# EAGLE design power (EAGLE 5.04)
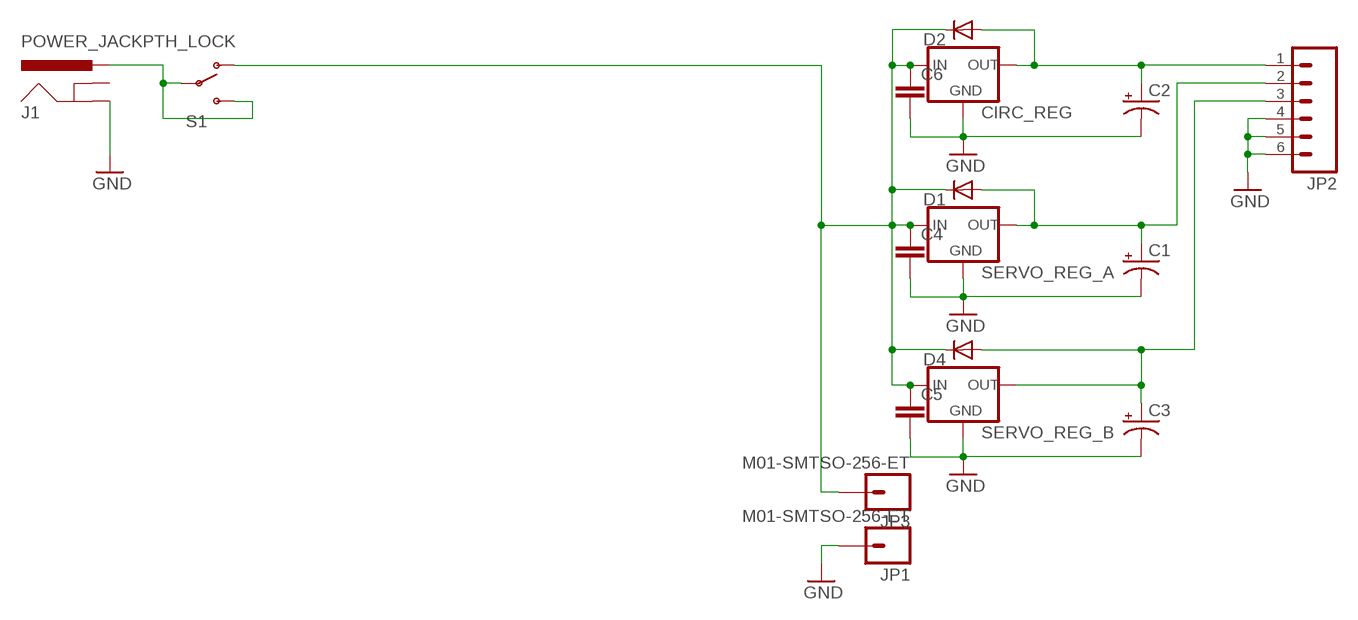
[diagram p0: schematic, sheet 1]

## Parts
C1  CAP_POLPTH1  [CPOL-RADIAL-100UF-25V]
C2  CAP_POLPTH2  [CPOL-RADIAL-10UF-25V]
C3  CAP_POLPTH1  [CPOL-RADIAL-100UF-25V]
C4  CAPPTH2  [CAP-PTH-SMALL2]
C5  CAPPTH2  [CAP-PTH-SMALL2]
C6  CAPPTH2  [CAP-PTH-SMALL2]
CIRC_REG  V_REG_78XXSIDE  [78XXL]
D1  DIODE1N4148  [DIODE-1N4148]
D2  DIODE1N4148  [DIODE-1N4148]
D4  DIODE1N4148  [DIODE-1N4148]
J1  POWER_JACKPTH_LOCK  [POWER_JACK_PTH_LOCK]
JP1  M01-SMTSO-256-ET  [SMTSO-256-ET]
JP2  M06SIP  [1X06]
JP3  M01-SMTSO-256-ET  [SMTSO-256-ET]
S1  SWITCH-SPSTPTH  [SWITCH-SPDT]
SERVO_REG_A  V_REG_78XXSIDE  [78XXL]
SERVO_REG_B  V_REG_78XXSIDE  [78XXL]

## Nets
GND: C1.2(-) C2.2(-) C3.2(-) C4.2 C5.2 C6.2 CIRC_REG.GND J1.GND JP1.P$1 JP2.4 JP2.5 JP2.6 SERVO_REG_A.GND SERVO_REG_B.GND
N$1: C2.1(+) CIRC_REG.OUT D2.A JP2.1
N$2: C1.1(+) D1.A JP2.2 SERVO_REG_A.OUT
N$4: C4.1 C5.1 C6.1 CIRC_REG.IN D1.C D2.C D4.C JP3.P$1 S1.1(O) SERVO_REG_A.IN SERVO_REG_B.IN
N$5: J1.PWR S1.2(P) S1.3(S)
N$9: C3.1(+) D4.A JP2.3 SERVO_REG_B.OUT
Unconnected: J1.GNDBREAK

## Library data of the parts
C1-C3 = SparkFun:CAP_POL: Capacitor Polarized These are standard SMD and PTH capacitors. Normally 10uF, 47uF, and 100uF in electrolytic and tantalum varieties. Always verify the external diameter of the through hole cap, it varies with capacity, voltage, and manufacturer. The EIA devices should be standard.
C4-C6 = SparkFun:CAP: Capacitor Standard 0603 ceramic capacitor, and 0.1" leaded capacitor.
CIRC_REG SERVO_REG_A SERVO_REG_B = SparkFun:V_REG_78XX: Voltage Regulator Standard 7805 5V regulator. IGO (Input Ground Output). Spark Fun Electronics SKU : COM-00107
D1 D2 D4 = SparkFun:DIODE: Diode These are standard reverse protection diodes and small signal diodes. SMA package can handle up to about 1A. SOD-323 can handle about 200mA. What the SOD-323 package when ordering, there are some mfgs out there that are 5-pin packages.
J1 = SparkFun:POWER_JACK: Power Jack This is the standard 5.5mm barrel jack for power. The PTH is the most common, proven, reliable, footprint. All others are experimental. The Slot footprint only works if the mill layer is transmitted to the PCB fab house so be warned. Spark Fun Electronics SKU : PRT-00119. Mating wall wart : TOL-00298 (and others)
JP1 JP3 = SparkFun:M01: Header 1 Standard 1-pin 0.1" header. Use with straight break away headers (SKU : PRT-00116), right angle break away headers (PRT-00553), swiss pins (PRT-00743), machine pins (PRT-00117), and female headers (PRT-00115).
JP2 = SparkFun:M06: Header 6 Standard 6-pin 0.1" header. Use with straight break away headers (SKU : PRT-00116), right angle break away headers (PRT-00553), swiss pins (PRT-00743), machine pins (PRT-00117), and female headers (PRT-00115). Molex polarized connector foot print use with SKU : PRT-08094 with associated crimp pins and housings. NOTES ON THE VARIANTS LOCK and LOCK_LONGPADS... This footprint was designed to help hold the alignment of a through-hole component (i.e. 6-pin header) while soldering it into place. You may notice that each hole has been shifted either up or down by 0.005 of an inch from it's more standard position (which is a perfectly straight line). This slight alteration caused the pins (the squares in the middle) to touch the edges of the holes. Because they are alternating, it causes a "brace" to hold the component in place. 0.005 has proven to be the perfect amount of "off-center" position when using our standard breakaway headers. Although looks a little odd when you look at the bare footprint, once you have a header in there, the alteration is very hard to notice. Also, if you push a header all the way into place, it is covered up entirely on the bottom side. This idea of altering the position of holes to aid alignment will be further integrated into the Sparkfun Library for other footprints. It can help hold any component with 3 or more connection pins.
S1 = SparkFun:SWITCH-SPST: SPST Switch Simple slide switch. Spark Fun Electronics SKU : COM-00102

## Board
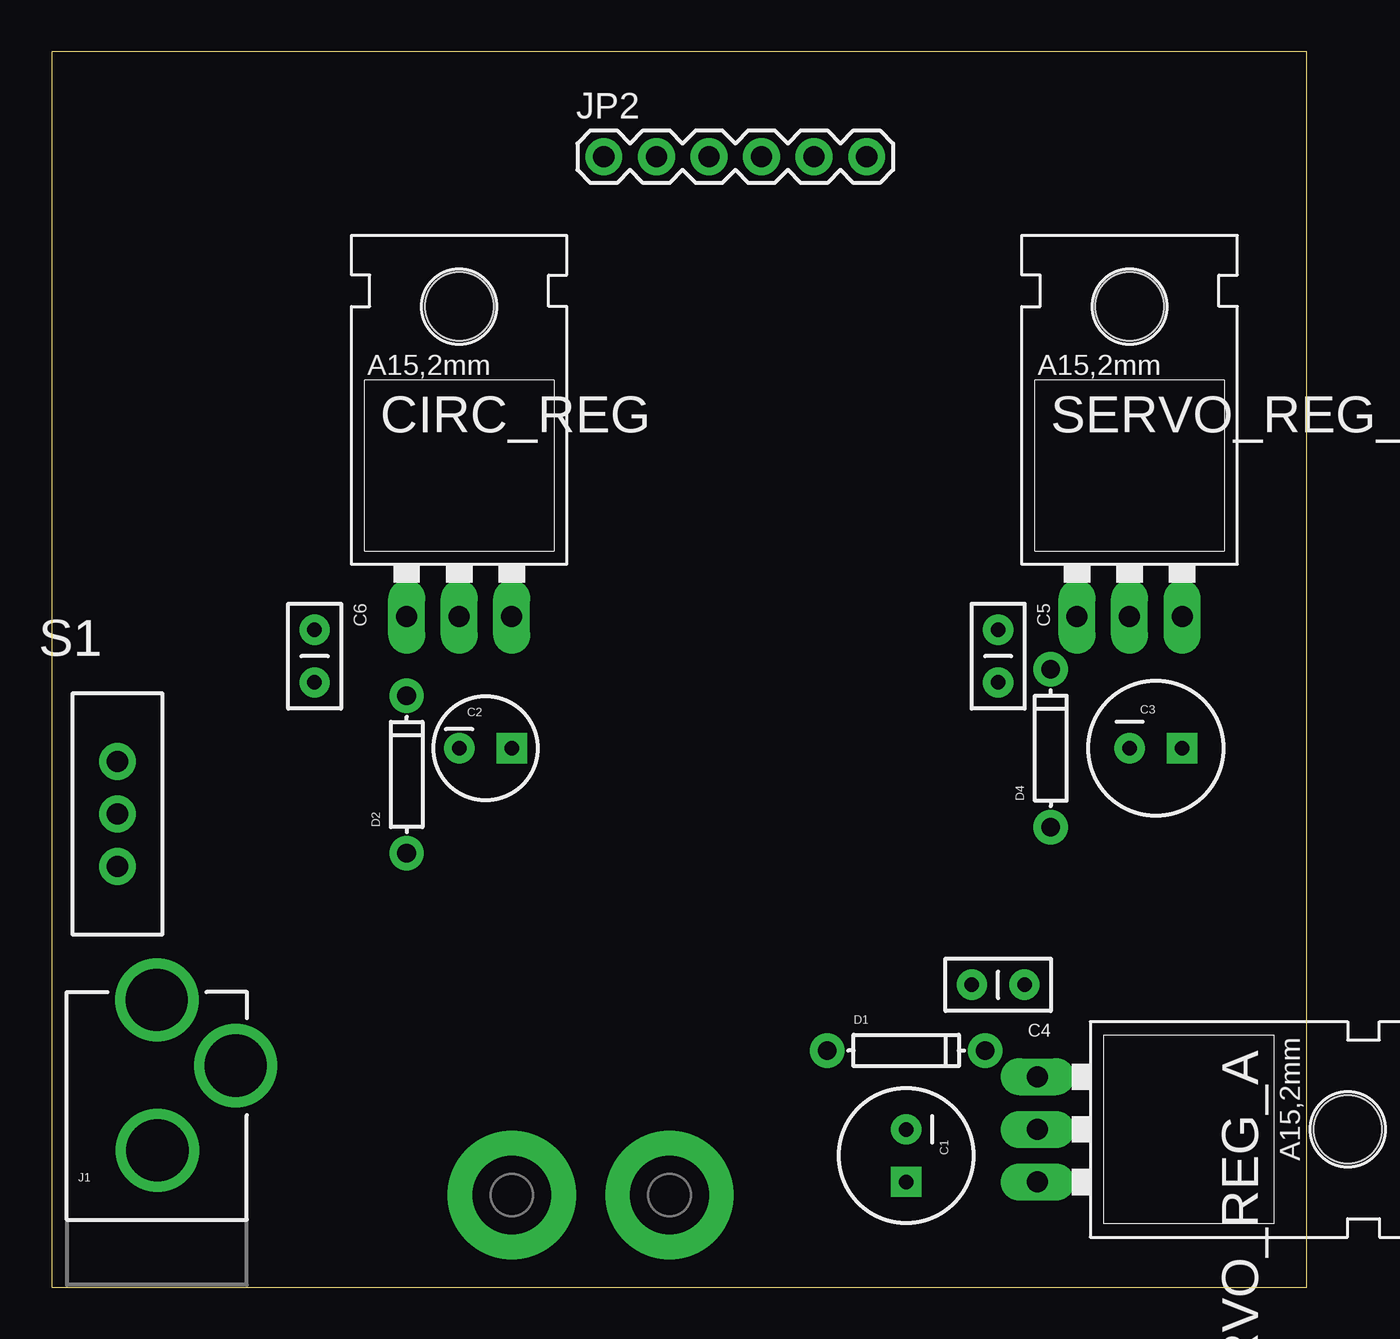
[diagram p1: board, top side]
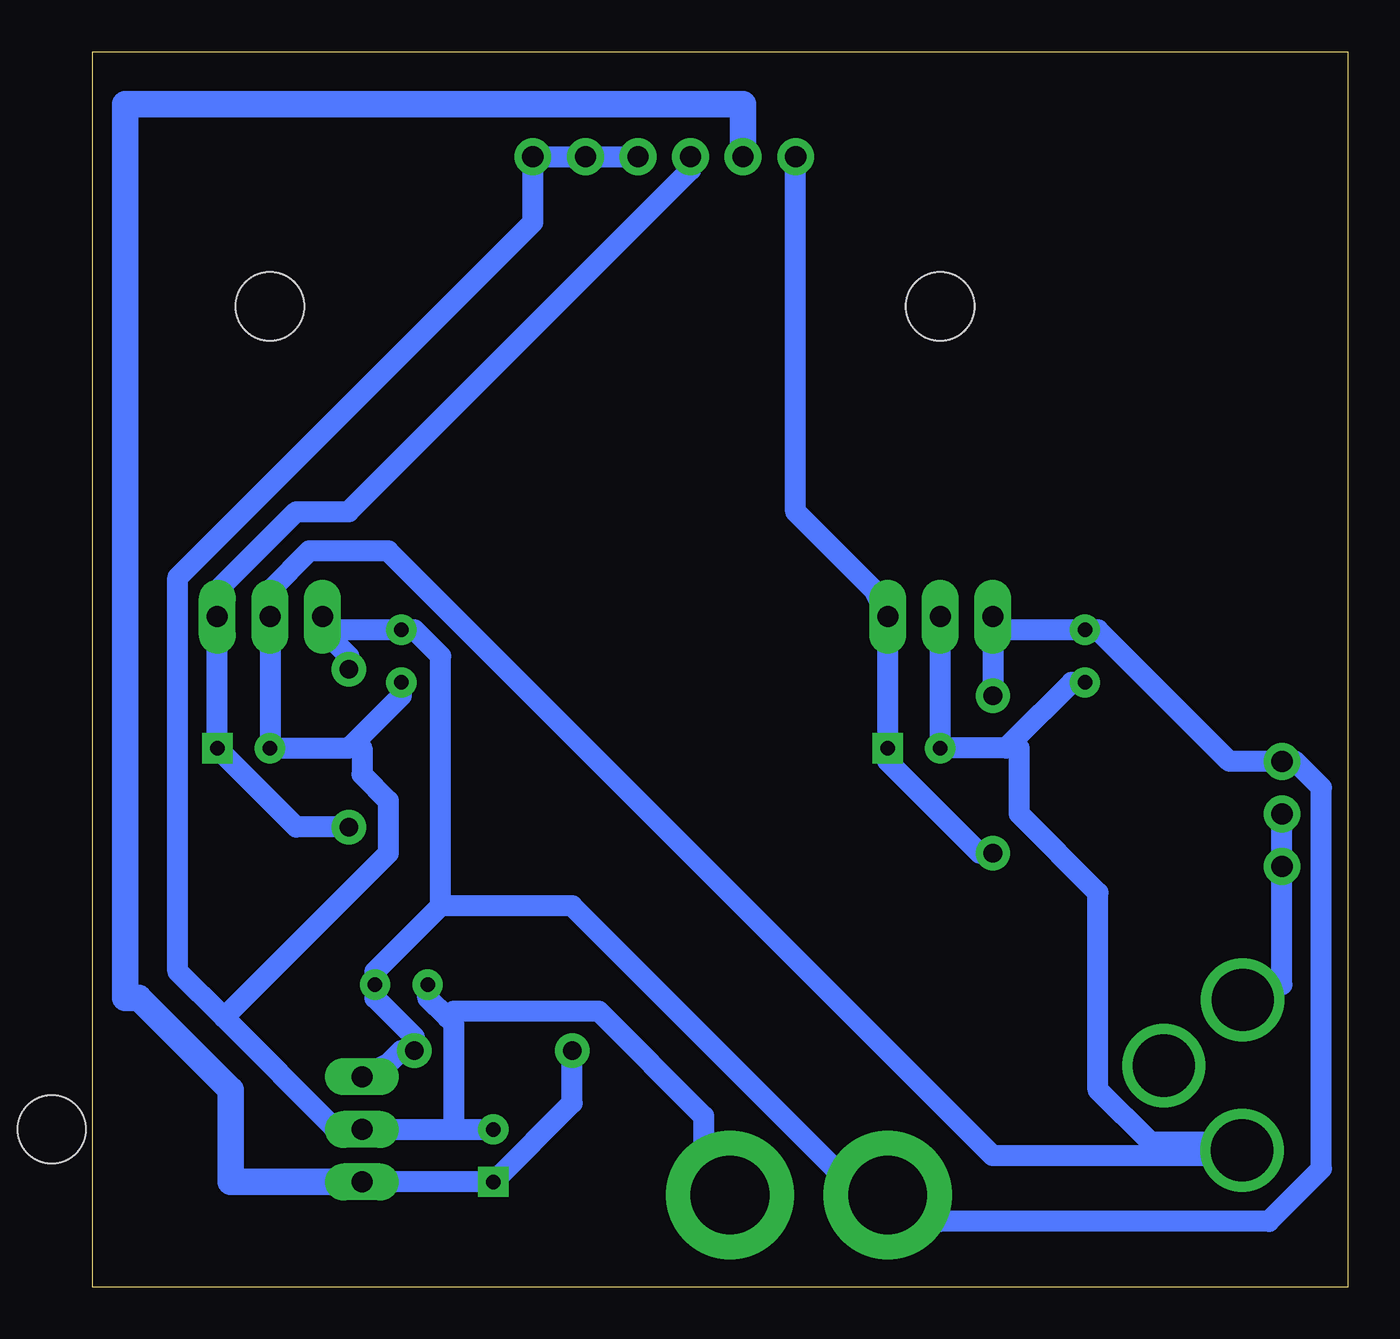
[diagram p2: board, bottom side, seen from below]

Size 60.63 x 59.68 mm. Coordinates in mm from the lower left corner, seen from the top.
Outline: 0,0 60.63,0 60.63,59.68 0,59.68 0,0
Copper layers (1*16): Top 0mm / dielectric 1.5mm / Bottom 0.035mm
Design rules "default *": minimum track width 40mil, minimum drill 24mil, track to track 20mil, track to pad 20mil, pad to pad 8mil, via to via 8mil, smd to smd 8mil, copper to edge 20mil, drill to drill 8mil, minimum pad ring 15mil, minimum via ring 8mil, stop-mask expansion 4mil, vias tented up to drill 0mil, thermal gap 10mil

### Footprints (pad centres in the part's own frame; a part is rotated, then mirrored left to right if it is on the bottom)
CPOL-RADIAL-100UF-25V = drill 0.7 square: 1 1.27,0 | drill 0.7 round: 2 -1.27,0
CPOL-RADIAL-10UF-25V = drill 0.7 square: 1 1.27,0 | drill 0.7 round: 2 -1.27,0
CAP-PTH-SMALL2 = drill 0.7 round: 1 0,0; 2 2.54,0
78XXL = drill 1.016 long: GND 0,-3.81; IN -2.54,-3.81; OUT 2.54,-3.81 | hole 3.302: 0,11.176
DIODE-1N4148 = drill 0.9 round: A -3.81,0; C 3.81,0
POWER_JACK_PTH_LOCK = drill 2.997 round: GND 0.025,6.608; GNDBREAK 3.812,10.7; PWR 0,13.878
SMTSO-256-ET = drill 3.81 pad 6.198 round: P$1 0,0
1X06 = drill 1.016 round: 1 0,0; 2 2.54,0; 3 5.08,0; 4 7.62,0; 5 10.16,0; 6 12.7,0
SWITCH-SPDT = drill 1.016 round: 1 0,2.54; 2 0,0; 3 0,-2.54

### Placement (x,y rotation side)
C1  41.27,6.35 270 top
C2  20.95,26.04 0 top
C3  53.34,26.04 0 top
C4  46.99,14.61 180 top
C5  45.72,31.75 270 top
C6  12.7,31.75 270 top
CIRC_REG  19.68,36.2 0 top
D1  41.27,11.43 0 top
D2  17.14,24.77 90 top
D4  48.26,26.04 90 top
J1  5.08,0 0 top
JP1  29.84,4.45 0 top
JP2  26.67,54.61 0 top
JP3  22.23,4.45 0 top
S1  3.17,22.86 0 top
SERVO_REG_A  51.44,7.62 270 top
SERVO_REG_B  52.07,36.2 0 top

### Tracks (layer width: path | path; a pad name or v marks a point on that pad's centre or on a via)
GND
  Bottom 1.016: CIRC_REG.GND C2.2 16.51,26.04 16.19,26.35 | 16.19,26.35 13.34,29.21 C6.2 | 16.19,26.35 15.88,26.04 15.88,22.86 12.06,19.05 12.06,9.53 9.53,6.99 6.99,6.99 J1.GND 6.99,6.35 17.14,6.35 46.35,35.56 50.16,35.56 52.07,33.66 SERVO_REG_B.GND C3.2 48.26,26.04 47.94,26.35 | 47.94,26.35 45.72,28.57 C5.2 | JP2.4 JP2.5 JP2.6 39.37,51.44 56.52,34.29 56.52,15.24 54.29,13.02 | 43.18,7.62 C1.2 | 43.18,7.62 SERVO_REG_A.GND 48.9,7.62 54.29,13.02 | 43.5,13.02 43.18,12.7 43.18,7.62 | 43.5,13.02 44.45,13.97 C4.2 | 47.94,26.35 47.62,26.04 47.62,24.77 46.35,23.5 46.35,20.95 54.29,13.02 | JP1.P$1 31.11,6.99 31.11,8.26 36.2,13.34 43.18,13.34 43.5,13.02
N$1
  Bottom 1.016: D2.A 17.78,20.95 22.23,25.4 C2.1 CIRC_REG.OUT 22.86,33.66 26.67,37.47 JP2.1
N$2
  Bottom 1.016: SERVO_REG_A.OUT C1.1 37.47,8.89 D1.A
  Bottom 1.27: JP2.2 29.21,57.15 59.05,57.15 59.05,13.97 58.42,13.97 53.98,9.53 53.98,5.08 SERVO_REG_A.OUT
N$4
  Bottom 1.016: D4.C 48.26,30.48 48.9,31.11 SERVO_REG_B.IN 48.9,31.75 C5.1 45.09,31.75 43.81,30.48 43.81,18.41 | SERVO_REG_A.IN 46.35,10.79 45.72,11.43 D1.C 45.09,12.06 46.99,13.97 C4.1 46.99,15.24 43.81,18.41 | D2.C CIRC_REG.IN 16.51,31.75 C6.1 12.06,31.75 5.71,25.4 S1.1 2.54,25.4 1.27,24.13 1.27,5.71 3.81,3.17 19.68,3.17 JP3.P$1 24.77,5.71 37.47,18.41 43.81,18.41
N$5
  Bottom 1.016: S1.2 S1.3 3.17,14.61 J1.PWR
N$9
  Bottom 1.016: D4.A 50.8,22.23 C3.1 SERVO_REG_B.OUT 54.61,33.66 50.8,37.47 48.26,37.47 31.75,53.98 JP2.3